# EasyEDA Pro project Solkatstice_v1.1_2025-04-18.epro, board Solkatstice_Top
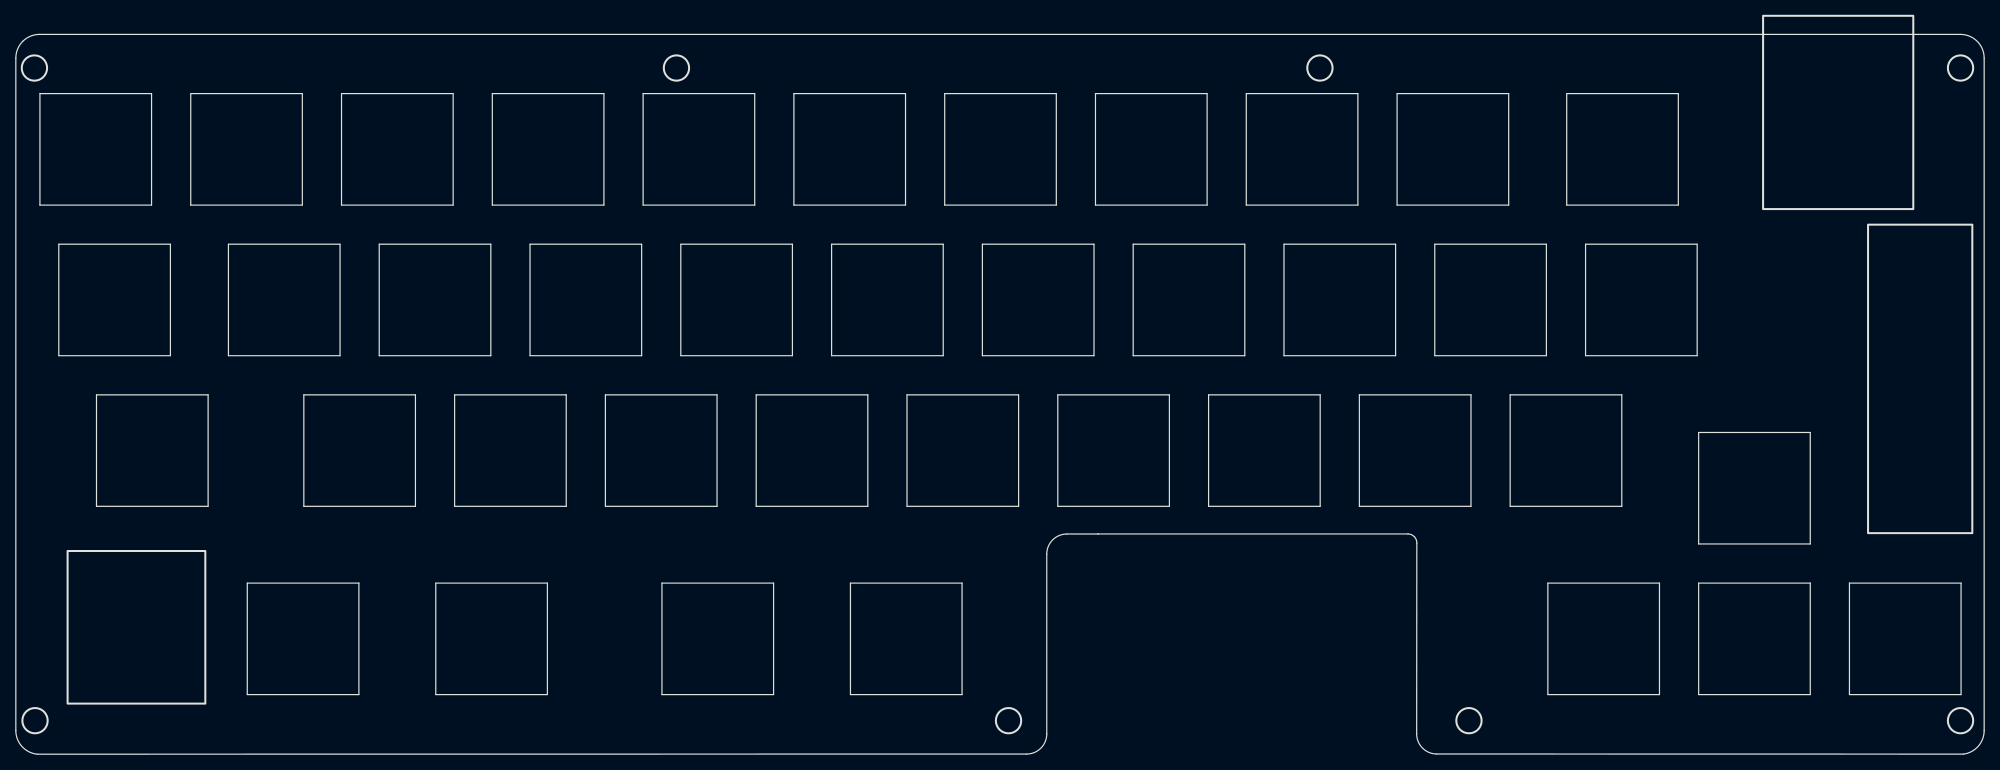
[diagram p4: board, top side]
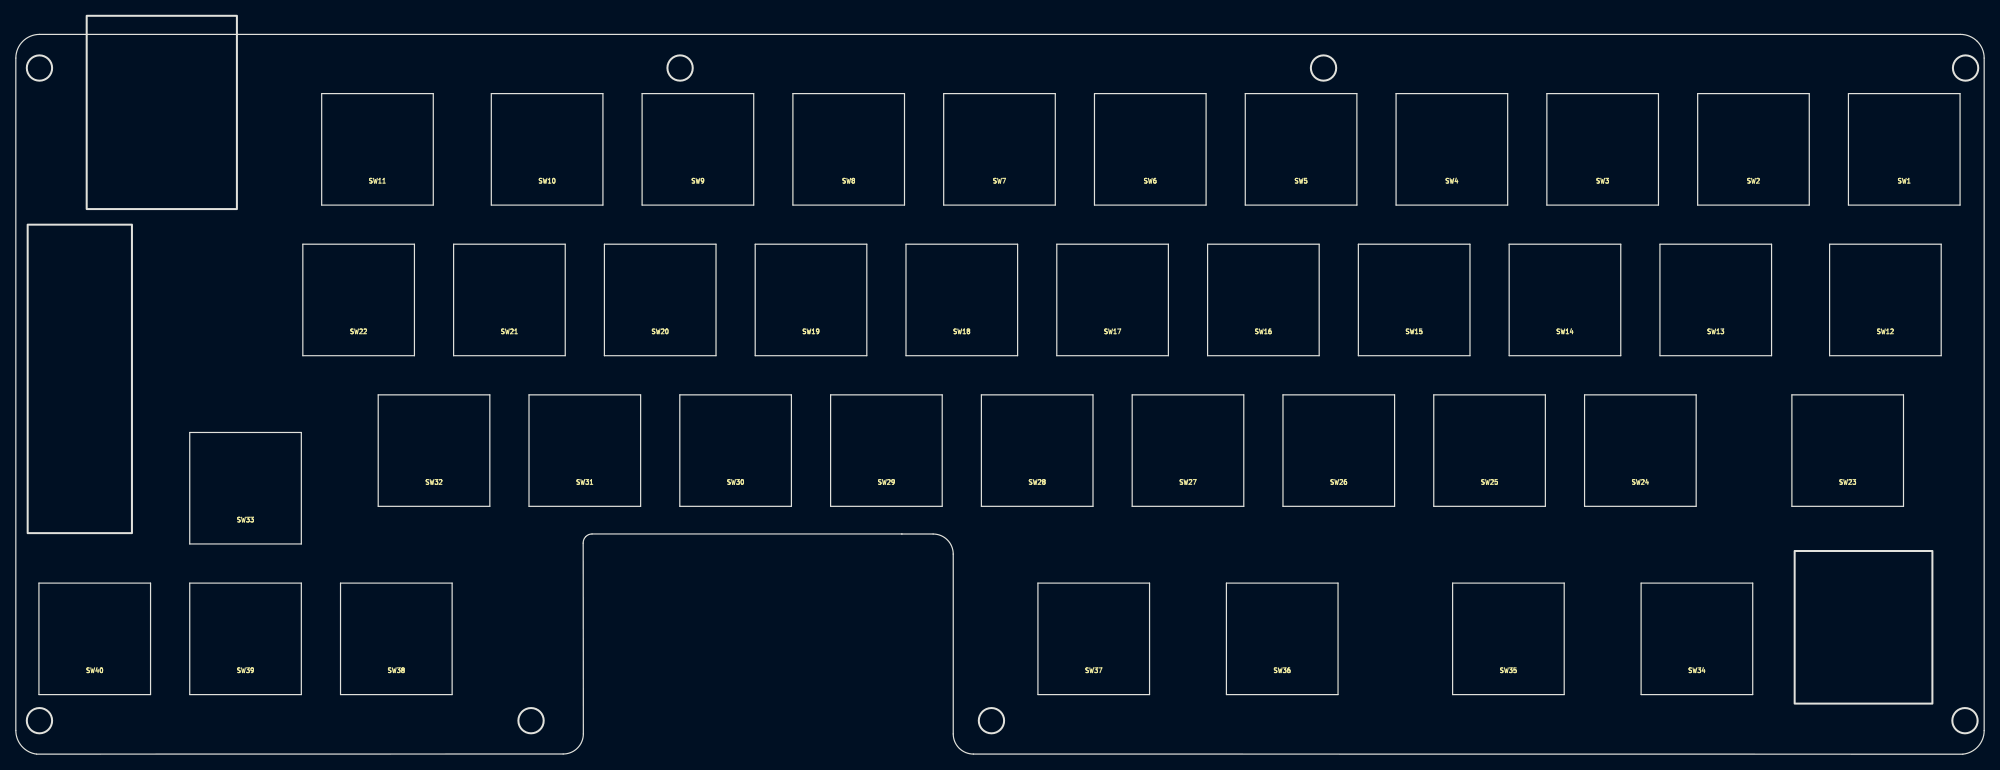
[diagram p5: board, bottom side, seen from below]

Outline 248.67 x 93.39 mm; copper layers: Top Layer, Bottom Layer. Coordinates in mm from the lower left corner of the outline.
Outline path: circle c2.35,86.79 r1.6 ; circle c2.42,4.24 r1.6 ; rectangle 6.54,25.7 23.94,6.4 ; circle c83.46,86.79 r1.6 ; circle c125.41,4.24 r1.6 ; circle c164.75,86.79 r1.6 ; circle c183.58,4.24 r1.6 ; rectangle 220.74,93.39 239.71,68.95 ; rectangle 234,66.98 247.17,27.96 ; circle c245.68,86.79 r1.6 ; circle c245.68,4.24 r1.6 ; 0,88.04 arc(0.23,89.19) 0.88,90.17 arc(1.85,90.82) 3,91.04 245.67,91.04 arc(247.79,90.16) 248.67,88.04 248.67,2.98 arc(247.92,1) 246.05,0.01 179.51,0.02 arc(177.72,0.77) 176.97,2.56 176.99,26.7 arc(176.92,27.14) 176.68,27.51 arc(176.31,27.77) 175.87,27.86 136.73,27.86 arc(136.73,27.85) 136.73,27.85 132.78,27.85 arc(130.98,27.1) 130.24,25.31 130.24,2.56 arc(129.5,0.76) 127.7,0.02 2.7,0 arc(0.77,0.97) 0,2.98 0,88.04
Stack: Top Layer 0.035mm / Dielectric1 1.51mm FR4 er 4.5 / Bottom Layer 0.035mm

## Design rules (mm)
template: User Custom Config
spacing safeClearance (default): track to track 0.152, other pairs 0.152 to 0.3
track width trackWidth (default): min 0.127, default 0.254, max 2.54
differential pair differentialPair (default): width min 0.127, default 0.254, max 2.54; gap min 0.152, default 0.152
via viaSize (default): diameter min 0.5, default 0.61, max 10; hole min 0.3, default 0.305, max 5.999

## Placement (name value [footprint] x y rotation side)
SW1  SW_PUSH  [SW_Hole_1u_JLC_1]  10.1 76.5 180 bottom
SW2  SW_PUSH  [SW_Hole_1u_JLC_1]  29.15 76.5 180 bottom
SW3  SW_PUSH  [SW_Hole_1u_JLC_1]  48.2 76.5 180 bottom
SW4  SW_PUSH  [SW_Hole_1u_JLC_1]  67.25 76.5 180 bottom
SW5  SW_PUSH  [SW_Hole_1u_JLC_1]  86.3 76.5 180 bottom
SW6  SW_PUSH  [SW_Hole_1u_JLC_1]  105.35 76.5 180 bottom
SW7  SW_PUSH  [SW_Hole_1u_JLC_1]  124.4 76.5 180 bottom
SW8  SW_PUSH  [SW_Hole_1u_JLC_1]  143.45 76.5 180 bottom
SW9  SW_PUSH  [SW_Hole_1u_JLC_1]  162.5 76.5 180 bottom
SW10  SW_PUSH  [SW_Hole_1u_JLC_1]  181.55 76.5 180 bottom
SW11  SW_PUSH  [SW_Hole_1u_JLC_1]  202.98 76.5 180 bottom
SW12  SW_PUSH  [SW_Hole_1u_JLC_1]  12.48 57.45 180 bottom
SW13  SW_PUSH  [SW_Hole_1u_JLC_1]  33.91 57.45 180 bottom
SW14  SW_PUSH  [SW_Hole_1u_JLC_1]  52.96 57.45 180 bottom
SW15  SW_PUSH  [SW_Hole_1u_JLC_1]  72.01 57.45 180 bottom
SW16  SW_PUSH  [SW_Hole_1u_JLC_1]  91.06 57.45 180 bottom
SW17  SW_PUSH  [SW_Hole_1u_JLC_1]  110.11 57.45 180 bottom
SW18  SW_PUSH  [SW_Hole_1u_JLC_1]  129.16 57.45 180 bottom
SW19  SW_PUSH  [SW_Hole_1u_JLC_1]  148.21 57.45 180 bottom
SW20  SW_PUSH  [SW_Hole_1u_JLC_1]  167.26 57.45 180 bottom
SW21  SW_PUSH  [SW_Hole_1u_JLC_1]  186.31 57.45 180 bottom
SW22  SW_PUSH  [SW_Hole_1u_JLC_1]  205.36 57.45 180 bottom
SW23  SW_PUSH  [SW_Hole_1u_JLC_1]  17.24 38.4 180 bottom
SW24  SW_PUSH  [SW_Hole_1u_JLC_1]  43.43 38.4 180 bottom
SW25  SW_PUSH  [SW_Hole_1u_JLC_1]  62.48 38.4 180 bottom
SW26  SW_PUSH  [SW_Hole_1u_JLC_1]  81.53 38.4 180 bottom
SW27  SW_PUSH  [SW_Hole_1u_JLC_1]  100.58 38.4 180 bottom
SW28  SW_PUSH  [SW_Hole_1u_JLC_1]  119.63 38.4 180 bottom
SW29  SW_PUSH  [SW_Hole_1u_JLC_1]  138.68 38.4 180 bottom
SW30  SW_PUSH  [SW_Hole_1u_JLC_1]  157.73 38.4 180 bottom
SW31  SW_PUSH  [SW_Hole_1u_JLC_1]  176.78 38.4 180 bottom
SW32  SW_PUSH  [SW_Hole_1u_JLC_1]  195.83 38.4 180 bottom
SW33  SW_PUSH  [SW_Hole_1u_JLC_1]  219.65 33.64 180 bottom
SW34  SW_PUSH  [SW_Hole_1u_JLC_1]  36.29 14.59 180 bottom
SW35  SW_PUSH  [SW_Hole_1u_JLC_1]  60.1 14.59 180 bottom
SW36  SW_PUSH  [SW_Hole_1u_JLC_1]  88.68 14.59 180 bottom
SW37  SW_PUSH  [SW_Hole_1u_JLC_1]  112.49 14.59 180 bottom
SW38  SW_PUSH  [SW_Hole_1u_JLC_1]  200.6 14.59 180 bottom
SW39  SW_PUSH  [SW_Hole_1u_JLC_1]  219.65 14.59 180 bottom
SW40  SW_PUSH  [SW_Hole_1u_JLC_1]  238.7 14.59 180 bottom

## Nets
As in the schematic.
